# Altium schematic sheet LOG.SchDoc
size A4
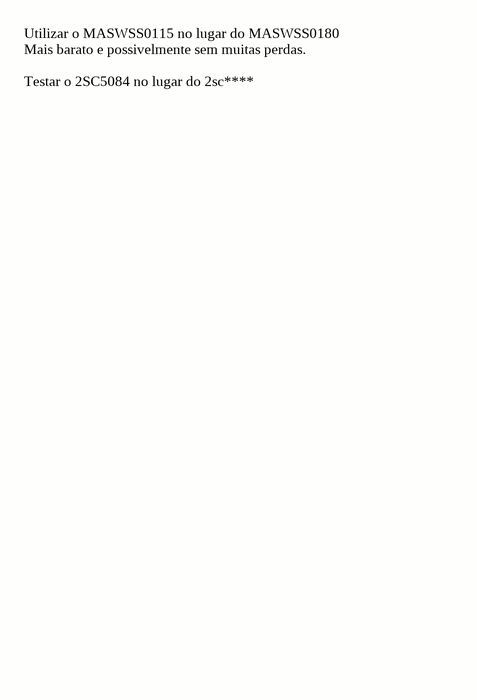
[diagram p0: LOG.SchDoc]

## Notes on the sheet
- Utilizar o MASWSS0115 no lugar do MASWSS0180
  Mais barato e possivelmente sem muitas perdas.
  Testar o 2SC5084 no lugar do 2sc****